# EAGLE design RGBWW (EAGLE 7.6.0)
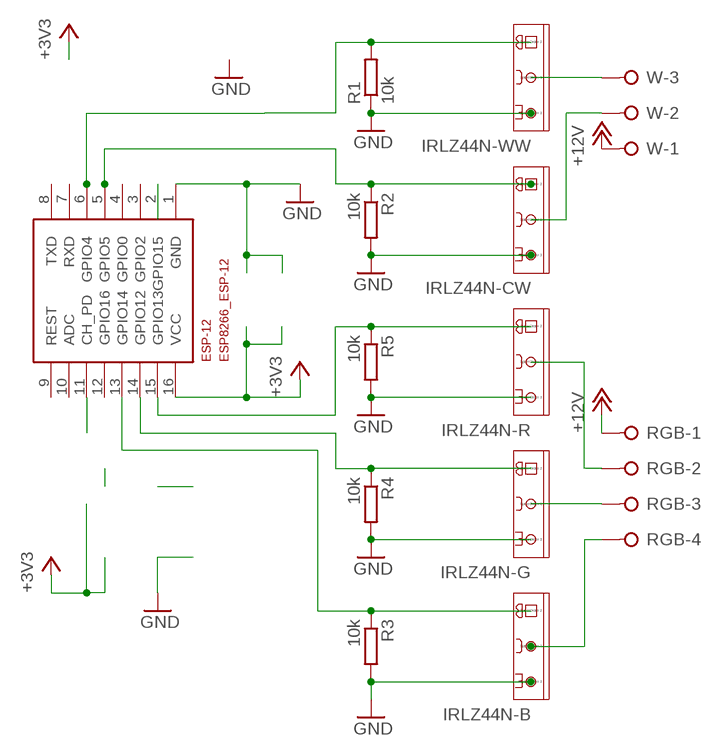
[diagram p0: schematic, sheet 1]

## Parts
ESP-12  ESP8266_ESP-12  [ESP8266-ESP12]
IRLZ44N-B  TIP121  [TO220AV]
IRLZ44N-CW  TIP121  [TO220AV]
IRLZ44N-G  TIP121  [TO220AV]
IRLZ44N-R  TIP121  [TO220AV]
IRLZ44N-WW  TIP121  [TO220AV]
R1  10k  R-EU_R0805  [R0805]
R2  10k  R-EU_R0805  [R0805]
R3  10k  R-EU_R0805  [R0805]
R4  10k  R-EU_R0805  [R0805]
R5  10k  R-EU_R0805  [R0805]
RGB  W237-04P  [W237-4P]
W  W237-03P  [W237-133]

## Nets
+3V3: ESP-12.16(VCC)
+12V: RGB.1 W.1
GND: ESP-12.1(GND) IRLZ44N-B.E IRLZ44N-CW.E IRLZ44N-G.E IRLZ44N-R.E IRLZ44N-WW.E R1.1 R2.2 R3.2 R4.2 R5.2
N$2 [Signal]: ESP-12.11(CH_PD)
N$7: ESP-12.2(GPIO15)
RGB-B: ESP-12.13(GPIO14) IRLZ44N-B.B R3.1
RGB-B-OUT: IRLZ44N-B.C RGB.4
RGB-CW: ESP-12.5(GPIO5) IRLZ44N-CW.B R2.1
RGB-CW-OUT: IRLZ44N-CW.C W.2
RGB-G: ESP-12.14(GPIO12) IRLZ44N-G.B R4.1
RGB-G-OUT: IRLZ44N-G.C RGB.3
RGB-R: ESP-12.15(GPIO13) IRLZ44N-R.B R5.1
RGB-R-OUT: IRLZ44N-R.C RGB.2
RGB-WW [Signal]: ESP-12.6(GPIO4) IRLZ44N-WW.B R1.2
RGB-WW-OUT: IRLZ44N-WW.C W.3
Unconnected: ESP-12.3(GPIO2) ESP-12.4(GPIO0) ESP-12.7(RXD) ESP-12.8(TXD) ESP-12.9(REST) ESP-12.10(ADC) ESP-12.12(GPIO16)

## Library data of the parts
ESP-12 = ESP8266-ESP12:ESP8266_ESP-12
IRLZ44N-B IRLZ44N-CW IRLZ44N-G IRLZ44N-R IRLZ44N-WW = PAsystem:TIP121: TO-220
R1-R5 = rcl:R-EU_: RESISTOR, European symbol
RGB = con-wago-508:W237-04P: WAGO SREW CLAMP; OC_FARNELL: unknown; OC_NEWARK: unknown
W = con-wago-508:W237-03P: WAGO SREW CLAMP; OC_FARNELL: unknown; OC_NEWARK: unknown

## Net classes
1 12V: width 0.508 mm
2 GNDRGB: width 0.508 mm
3 3.3V: width 0.508 mm
4 GND3.3V: width 0.508 mm
5 Signal: width 0.381 mm

## Board
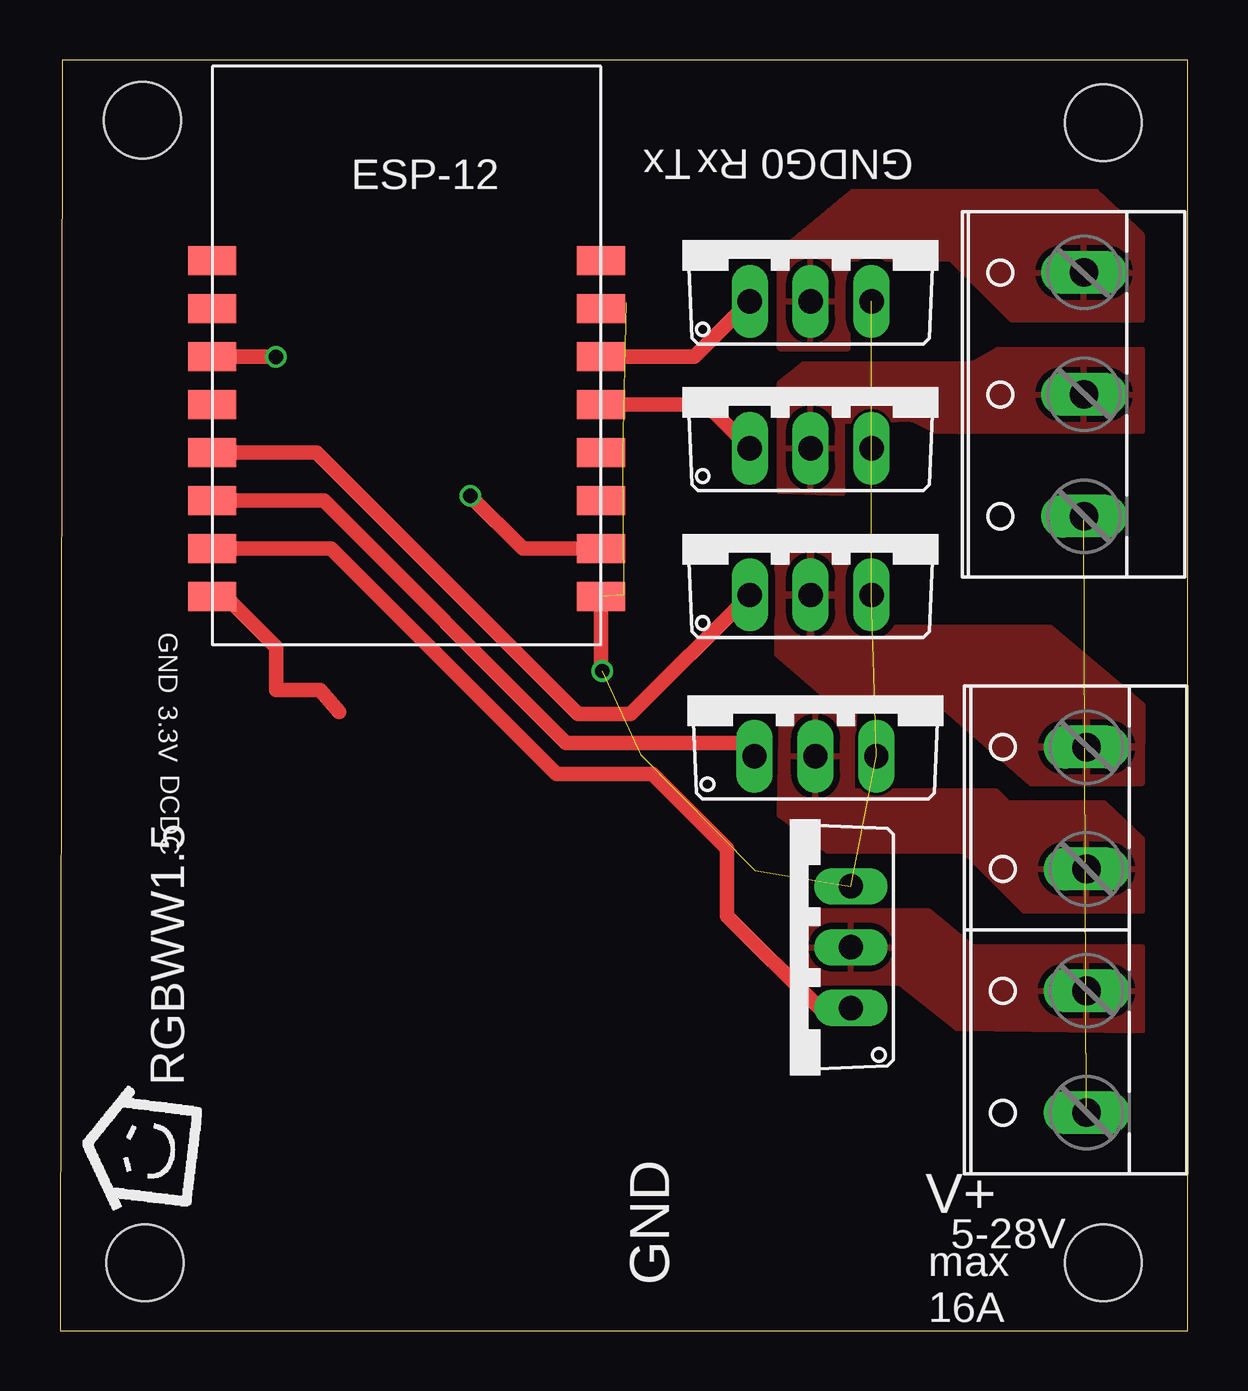
[diagram p1: board, top side]
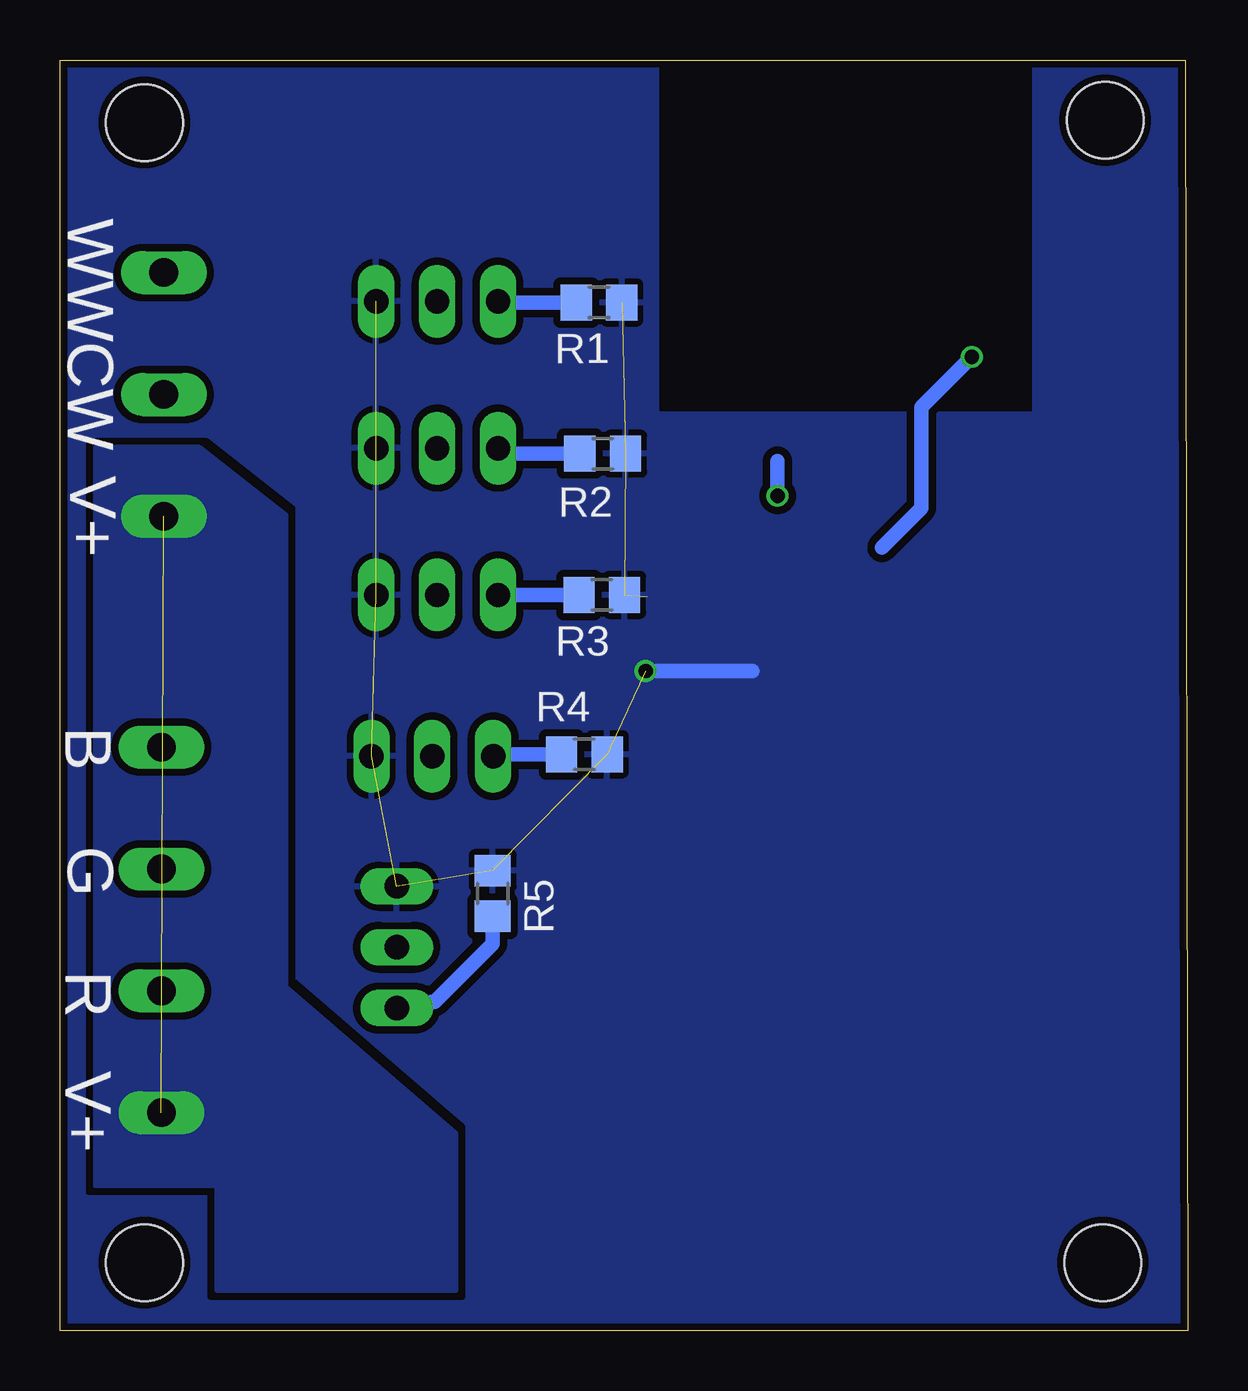
[diagram p2: board, bottom side, seen from below]

Size 47.01 x 52.97 mm. Coordinates in mm from the lower left corner, seen from the top.
Outline: 0,0 47.01,0 47.01,52.97 0.1,52.97 0,0
Copper layers (1*16): Top 0.035mm / dielectric 1.5mm / Bottom 0.035mm
Design rules "dirt_cheap_dirty_boards.v1": minimum track width 5mil, minimum drill 12mil, track to track 5mil, track to pad 5mil, pad to pad 5mil, via to via 5mil, smd to smd 0mil, copper to edge 10mil, drill to drill 10mil, minimum pad ring 10mil, minimum via ring 6mil, stop-mask expansion 2mil, vias tented up to drill 25mil, thermal gap 10mil
Holes 3.2 mm at 3.54,2.84 43.49,2.84 43.49,50.36 3.44,50.46

### Footprints (pad centres in the part's own frame; a part is rotated, then mirrored left to right if it is on the bottom)
ESP8266-ESP12 = smd 2 x 1.2: 1 16.2,2; 2 16.2,4; 3 16.2,6; 4 16.2,8; 5 16.2,10; 6 16.2,12; 7 16.2,14; 8 16.2,16; 9 0,16; 10 0,14; 11 0,12; 12 0,10; 13 0,8; 14 0,6; 15 0,4; 16 0,2
TO220AV = drill 1.016 long: B -2.54,-2.54; C 0,-2.54; E 2.54,-2.54
R0805 = smd 1.3 x 1.5: 1 -0.95,0; 2 0.95,0
W237-4P = drill 1.194 long: 1 -7.62,-0.635; 2 -2.54,-0.635; 3 2.54,-0.635; 4 7.62,-0.635
W237-133 = drill 1.194 long: 1 -5.08,-0.635; 2 0,-0.635; 3 5.08,-0.635

### Placement (x,y rotation side)
ESP-12  6.35,28.6 0 top
IRLZ44N-B  31.29,33.21 0 top
IRLZ44N-CW  31.29,39.33 0 top
IRLZ44N-G  31.49,26.49 0 top
IRLZ44N-R  30.43,15.99 90 top
IRLZ44N-WW  31.29,45.45 0 top
R1  24.54,42.86 180 bottom
R2  24.39,36.56 0 bottom
R3  24.43,30.67 0 bottom
R4  25.15,24.03 0 bottom
R5  28.97,18.23 90 bottom
RGB  42.15,16.71 90 top
U$1  [LOGO]  6.04,5.04 90 top
W  42.05,39.03 90 top

### Tracks (layer width: path | path; a pad name or v marks a point on that pad's centre or on a via)
+3V3
  Top 0.61: ESP-12.16 6.9,30.6 9,28.5 9,26.7 10.84,26.7 11.64,25.79
+12V  (1 unrouted)
  pour Bottom (isolate 0.305, no thermals): 40.45,1.7 30.53,1.7 30.53,8.22 37.6,14.32 37.6,33.98 41.18,36.79 45.53,36.79 45.53,6.08 40.45,6.08
GND  (via drill 0.6)  (10 unrouted)
  Top 0.61: ESP-12.1 22.55,27.85 v22.6,27.5
  Bottom 0.61: v22.6,27.5 18.14,27.5
  pour Bottom (isolate 0.305, rank 6): 0,53 -0.1,0 47.03,0.2 47.13,53.2 22.16,52.9 22.16,38.2 6.35,38.2 6.35,52.9
N$2  (via drill 0.6)
  Top 0.61: v9,40.6 ESP-12.11
  Bottom 0.61: 12.76,32.64 11.1,34.3 11.1,38.5 v9,40.6
N$7  (via drill 0.6)
  Top 0.61: ESP-12.2 19.3,32.6 v17.1,34.8
  Bottom 0.61: v17.1,34.8 17.1,36.24
RGB-B
  Top 0.61: ESP-12.13 10.7,36.6 21.6,25.7 23.78,25.7 IRLZ44N-B.B
  Bottom 0.61: R3.1 IRLZ44N-B.B
RGB-B-OUT
  pour Top (isolate 0.305, rank 6): 45.09,26.06 45.08,22.86 40.5,22.84 36.3,26.5 31.9,26.5 29.92,28.2 29.92,32.68 32.69,32.65 32.77,30.15 33.55,29.27 41.29,29.27
RGB-CW
  Top 0.61: ESP-12.5 26.94,38.6 IRLZ44N-CW.B
  Bottom 0.61: R2.1 28.52,36.56 IRLZ44N-CW.B
RGB-CW-OUT
  pour Top: 32.6,34.9 30,35 30,39.5 31,40.3 38,40.3 39.1,40.9 45.1,40.9 45.1,37.5 36.5,37.5 35.5,38 32.6,37.9
RGB-G
  Top 0.61: ESP-12.14 11,34.6 21.1,24.5 28.4,24.5 IRLZ44N-G.B
  Bottom 0.61: R4.1 28.87,24.03 IRLZ44N-G.B
RGB-G-OUT
  pour Top: 30.1,25.9 33.1,25.9 33,22.5 39,22.5 39.5,22 43.5,22 45.1,20.5 45.1,17.5 40.2,17.5 37.7,20 32,20 30,21.5
RGB-R
  Top 0.61: IRLZ44N-R.B 31.65,13.45 27.8,17.3 27.8,20.1 24.7,23.2 20.7,23.2 11.3,32.6 ESP-12.15
  Bottom 0.61: R5.1 28.97,16.13 31.4,13.7 31.55,13.7 31.8,13.45 IRLZ44N-R.B
RGB-R-OUT
  pour Top: 31,14.5 31,17.5 36.2,17.5 38,16 45.1,16 45.1,12.5 37.4,12.6 35,14.5
RGB-WW
  Top 0.61: ESP-12.6 26.44,40.6 IRLZ44N-WW.B
  Bottom 0.61: R1.2 28.7,42.86 IRLZ44N-WW.B
RGB-WW-OUT
  pour Top (isolate 0.305, rank 6): 45.09,42.14 39.68,42.14 37.14,44.68 32.83,44.68 32.83,40.94 30.02,40.94 30.02,44.95 33.06,47.49 43.18,47.49 45.09,45.68

### Text on the board
tNames: Tx | Rx | G0 | GND | GND | 3.3V | DCDC | RGBWW1.5 | V+ | GND | 5-28V | max / 16A
bNames: WW | CW | V+ | B | G | R | V+